# EAGLE design Vanocni (EAGLE 7.2.0)
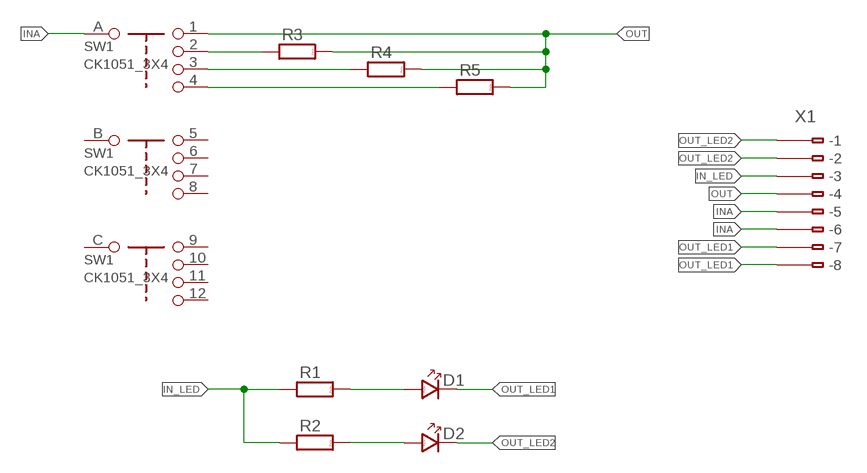
[diagram p0: schematic, sheet 1]

## Parts
D1  LED_5  [LED_5]
D2  LED_5  [LED_5]
R1  R_7,5  [R-7,5]
R2  R_7,5  [R-7,5]
R3  R__2W  [R-_2W]
R4  R__2W  [R-_2W]
R5  R__2W  [R-_2W]
SW1  CK1051_3X4  [SWITCH3X4]
X1  233-508  [233-508]

## Nets
IN_LED: R1.1 R2.1 X1.B3(B-3)
INA: SW1.A(A:A) X1.B5(B-5) X1.B6(B-6)
N$1: D1.A R1.2
N$4: D2.A R2.2
N$7: R3.1 SW1.2
N$8: R4.1 SW1.3
N$13: R5.1 SW1.4
OUT: R3.2 R4.2 R5.2 SW1.1 X1.B4(B-4)
OUT_LED1: D1.K X1.B7(B-7) X1.B8(B-8)
OUT_LED2: D2.K X1.B1(B-1) X1.B2(B-2)
Unconnected: SW1.5 SW1.6 SW1.7 SW1.8 SW1.9 SW1.10 SW1.11 SW1.12 SW1.B(B:A) SW1.C(C:A) X1.A1(-1) X1.A2(-2) X1.A3(-3) X1.A4(-4) X1.A5(-5) X1.A6(-6) X1.A7(-7) X1.A8(-8)

## Library data of the parts
D1 D2 = #PaJa_31:LED: LED - jednobarevna
R1-R5 = #PaJa_31:R: Rezistor
SW1 = #PaJa_prepinace:CK1051_3X4: Otocny prepinac 3 x 4
X1 = con-wago:233-508: WAGO Cage Clamp; MF: Wago Corporation; MPN: 0233-0508; OC_FARNELL: 1777101; OC_NEWARK: 79K2053

## Board
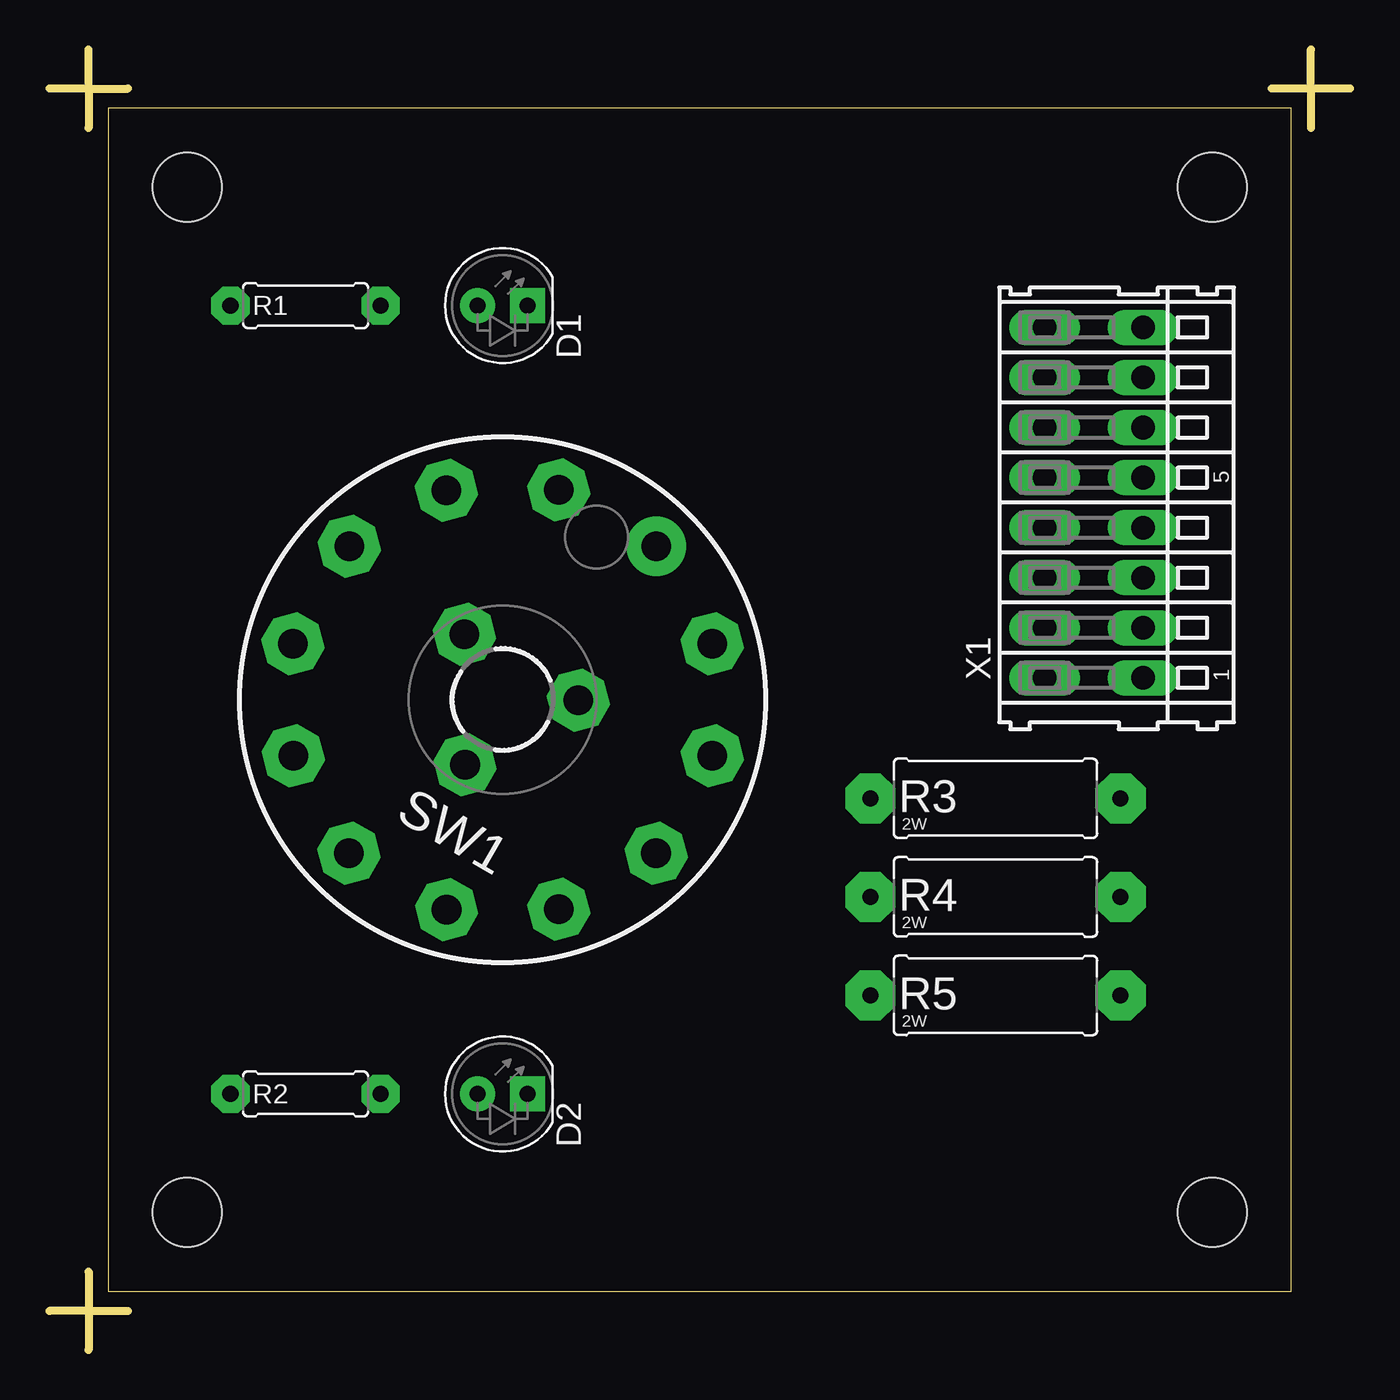
[diagram p1: board, top side]
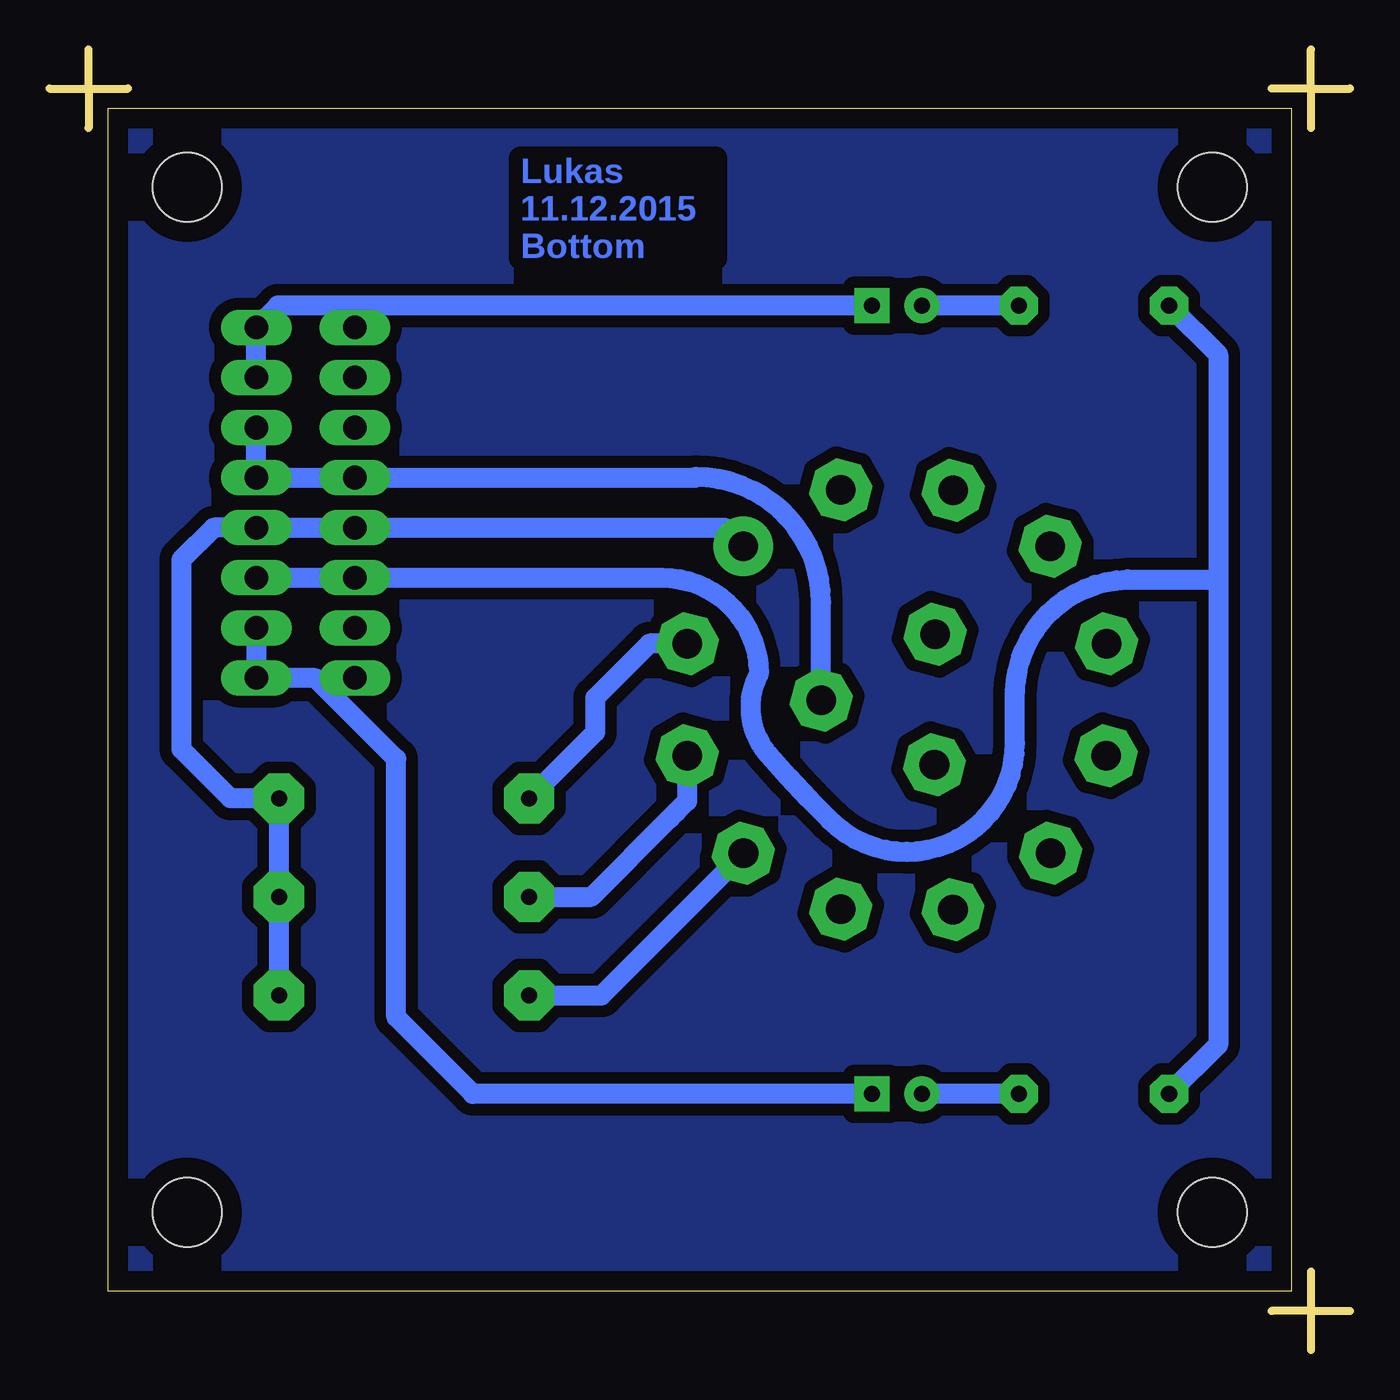
[diagram p2: board, bottom side, seen from below]

Size 66 x 66 mm. Coordinates in mm from the lower left corner, seen from the top.
Outline: 2,64 4,64
Outline: 2,64 2,62
Outline: 2,64 0,64
Outline: 2,64 2,66
Outline: 66,64 64,64
Outline: 64,64 62,64
Outline: 64,64 64,62
Outline: 64,64 64,66
Outline: 2,4 2,2
Outline: 2,2 4,2
Outline: 2,2 2,0
Outline: 2,2 0,2
Outline: 3,3 63,3 63,63 3,63 3,3
Copper layers (1*16): Top 0.035mm / dielectric 1.5mm / Bottom 0.035mm
Design rules "default": minimum track width 10mil, minimum drill 24mil, track to track 8mil, track to pad 8mil, pad to pad 8mil, via to via 8mil, smd to smd 8mil, copper to edge 40mil, drill to drill 8mil, minimum pad ring 10mil, minimum via ring 8mil, stop-mask expansion 4mil, vias tented up to drill 0mil, thermal gap 10mil
Holes 3.5 mm at 7,59 59,59 7,7 59,7

### Footprints (pad centres in the part's own frame; a part is rotated, then mirrored left to right if it is on the bottom)
LED_5 = drill 0.813 pad 1.778: A -1.27,0 | drill 0.813 pad 1.778 square: K 1.27,0
R-7,5 = drill 0.813 pad 1.93 octagon: 1 -3.81,0; 2 3.81,0
R-_2W = drill 0.813 pad 2.54 octagon: 1 -6.35,0; 2 6.35,0
SWITCH3X4 = drill 1.5 pad 3: 1 -2.857,-10.636 | drill 1.5 pad 3 octagon: 2 -7.779,-7.779; 3 -10.636,-2.857; 4 -10.636,2.857; 5 -7.779,7.779; 6 -2.857,10.636; 7 2.857,10.636; 8 7.779,7.779; 9 10.636,2.857; 10 10.636,-2.857; 11 7.779,-7.779; 12 2.857,-10.636; A -3.334,-1.905; B 0,3.81; C 3.334,-1.905
233-508 = drill 1.2 long: A1 -8.89,2.5; A2 -6.35,2.5; A3 -3.81,2.5; A4 -1.27,2.5; A5 1.27,2.5; A6 3.81,2.5; A7 6.35,2.5; A8 8.89,2.5; B1 -8.89,-2.5; B2 -6.35,-2.5; B3 -3.81,-2.5; B4 -1.27,-2.5; B5 1.27,-2.5; B6 3.81,-2.5; B7 6.35,-2.5; B8 8.89,-2.5

### Placement (x,y rotation side)
D1  23,53 0 top
D2  23,13 0 top
R1  13,53 0 top
R2  13,13 0 top
R3  48,28 0 top
R4  48,23 0 top
R5  48,18 0 top
SW1  23,33 150 top
X1  53,43 90 top

### Tracks (layer width: path | path; a pad name or v marks a point on that pad's centre or on a via)
IN_LED
  Bottom 1.016: R1.1 6.7,50.51 6.7,39 | 6.7,39 6.7,15.49 R2.1 | 6.7,39 6.8,39.1 11.3,39.1 arc-87 17,33.4 17,30.8 arc135 26.4,26.9 arc4 29.5,30.2 arc69 30,34.3 arc-90 34.89,39.19 X1.B3
INA
  Bottom 1.016: X1.B6 X1.B5 33.23,44.27 33.2,44.3 arc90 26.84,37.94 SW1.A
N$1
  Bottom 1.016: R1.2 D1.A
N$2
  pour Bottom (isolate 0.6): 3,3 63,3 63,63 3,63
N$4
  Bottom 1.016: R2.2 D2.A
N$7
  Bottom 1.016: SW1.2 35.55,35.85 38.3,33.1 38.3,31.35 R3.1
N$8
  Bottom 1.016: R4.1 38.5,23 34.5,27 34.2,27.3 33.64,27.86 SW1.3
N$13
  Bottom 1.016: R5.1 37.99,18 SW1.4
OUT
  Bottom 1.016: R5.2 R4.2 R3.2 56.8,28 59.3,30.5 59.3,40.1 57.67,41.73 X1.B4 31.74,41.73 SW1.1
OUT_LED1
  Bottom 1.016: D1.K 54.39,53 X1.B8 X1.B7
OUT_LED2
  Bottom 1.016: X1.B2 X1.B1 52.5,34.1 48.4,30 48.4,16.9 44.5,13 D2.K

### Text on the board
Bottom: Lukas / 11.12.2015 / Bottom